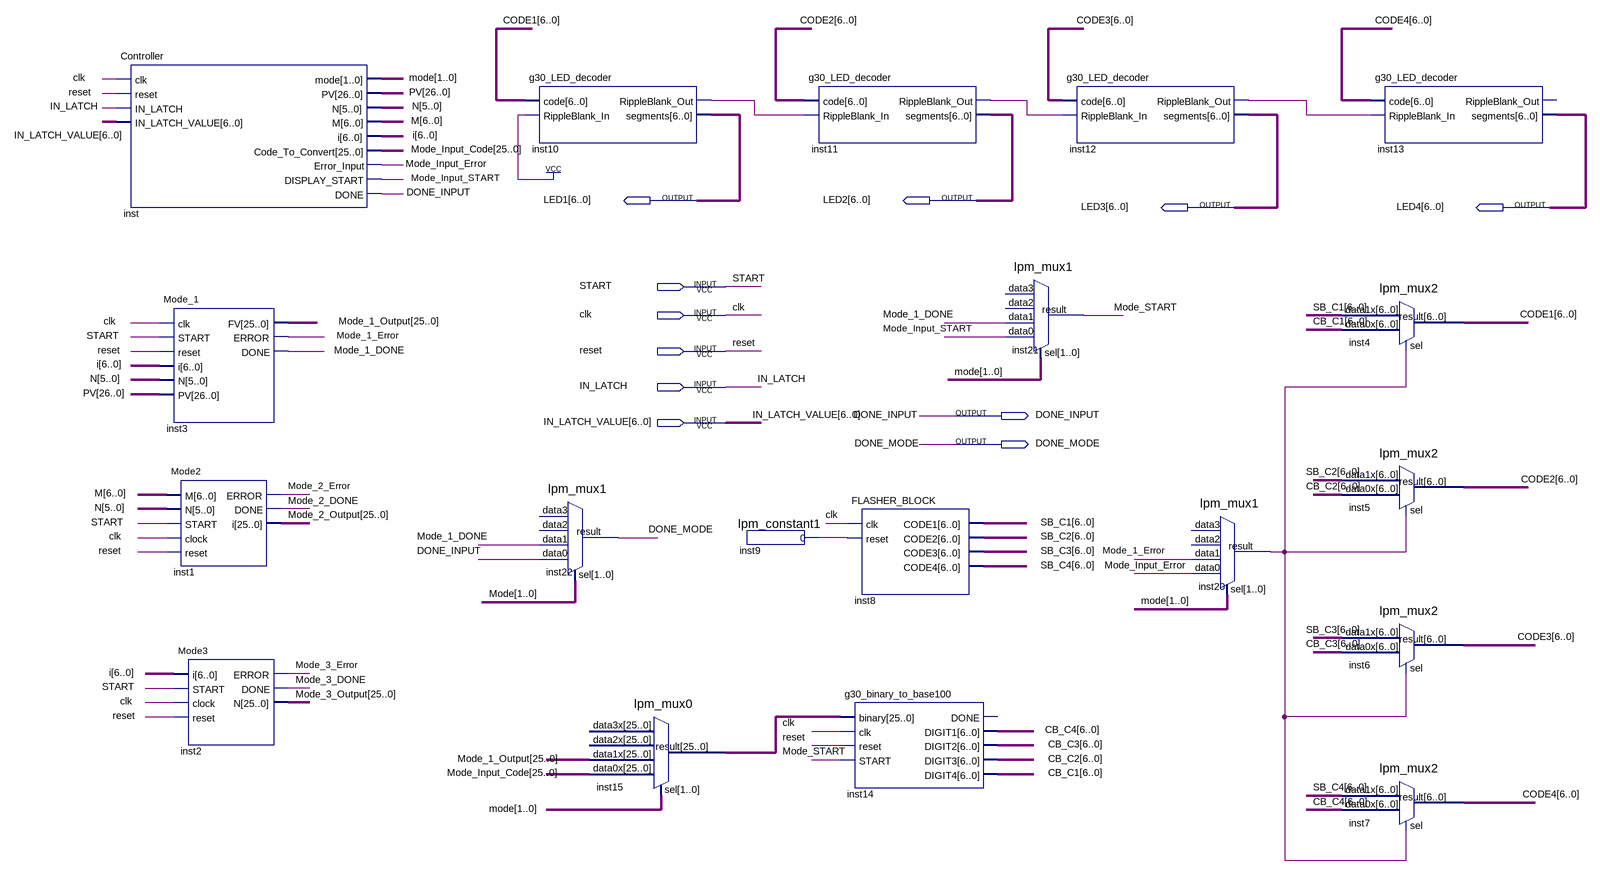
[diagram p0: schematic sheet]
// Quartus schematic g30_Base100_Financial_Calculator.bdf as structural Verilog: 19 symbols, 11 pins
module g30_Base100_Financial_Calculator (
  input  START,
  input  clk,
  input  reset,
  input  IN_LATCH,
  input  [6:0] IN_LATCH_VALUE,
  output [6:0] LED1,
  output [6:0] LED2,
  output [6:0] LED3,
  output [6:0] LED4,
  output DONE_INPUT,
  output DONE_MODE
);

  wire inst9_result, inst10_rippleblank_out, inst11_rippleblank_out, inst12_rippleblank_out, inst20_result,
       Mode_1_DONE, Mode_1_Error, Mode_2_DONE, Mode_2_Error, Mode_3_DONE, Mode_3_Error, Mode_Input_Error,
       Mode_Input_START, Mode_START;
  wire [1:0] mode;
  wire [5:0] N;
  wire [6:0] CB_C1, CB_C2, CB_C3, CB_C4, CODE1, CODE2, CODE3, CODE4, i, M, SB_C1, SB_C2, SB_C3, SB_C4;
  wire [25:0] inst15_result, Mode_1_Output, Mode_2_Output, Mode_3_Output, Mode_Input_Code;
  wire [26:0] PV;

  Controller inst (
    .clk(clk), .reset(reset), .IN_LATCH(IN_LATCH), .IN_LATCH_VALUE(IN_LATCH_VALUE), .mode(mode), .PV(PV),
    .N(N), .M(M), .i(i), .Code_To_Convert(Mode_Input_Code), .Error_Input(Mode_Input_Error),
    .DISPLAY_START(Mode_Input_START), .DONE(DONE_INPUT));
  Mode_1 inst3 (
    .clk(clk), .START(START), .reset(reset), .i(i), .N(N), .PV(PV), .FV(Mode_1_Output), .ERROR(Mode_1_Error),
    .DONE(Mode_1_DONE));
  Mode2 inst1 (
    .M(M), .N(N), .START(START), .clock(clk), .reset(reset), .ERROR(Mode_2_Error), .DONE(Mode_2_DONE),
    .i(Mode_2_Output));
  Mode3 inst2 (
    .i(i), .START(START), .clock(clk), .reset(reset), .ERROR(Mode_3_Error), .DONE(Mode_3_DONE),
    .N(Mode_3_Output));
  g30_LED_decoder inst10 (
    .code(CODE1), .RippleBlank_In(1'b1), .RippleBlank_Out(inst10_rippleblank_out), .segments(LED1));
  lpm_mux1 inst22 (.data1(Mode_1_DONE), .data0(DONE_INPUT), .sel(mode), .result(DONE_MODE));  // open: data3, data2
  lpm_mux0 inst15 (
    .data1x(Mode_1_Output), .data0x(Mode_Input_Code), .sel(mode), .result(inst15_result));  // open: data3x, data2x
  lpm_constant1 inst9 (.result(inst9_result));
  g30_LED_decoder inst11 (
    .code(CODE2), .RippleBlank_In(inst10_rippleblank_out), .RippleBlank_Out(inst11_rippleblank_out),
    .segments(LED2));
  FLASHER_BLOCK inst8 (.clk(clk), .reset(inst9_result), .CODE1(SB_C1), .CODE2(SB_C2), .CODE3(SB_C3), .CODE4(SB_C4));
  g30_binary_to_base100 inst14 (
    .binary(inst15_result), .clk(clk), .reset(reset), .START(Mode_START), .DIGIT1(CB_C4), .DIGIT2(CB_C3),
    .DIGIT3(CB_C2), .DIGIT4(CB_C1));  // open: DONE
  lpm_mux1 inst21 (
    .data1(Mode_1_DONE), .data0(Mode_Input_START), .sel(mode), .result(Mode_START));  // open: data3, data2
  g30_LED_decoder inst12 (
    .code(CODE3), .RippleBlank_In(inst11_rippleblank_out), .RippleBlank_Out(inst12_rippleblank_out),
    .segments(LED3));
  lpm_mux1 inst20 (
    .data1(Mode_1_Error), .data0(Mode_Input_Error), .sel(mode), .result(inst20_result));  // open: data3, data2
  lpm_mux2 inst4 (.data1x(SB_C1), .data0x(CB_C1), .sel(inst20_result), .result(CODE1));
  lpm_mux2 inst5 (.data1x(SB_C2), .data0x(CB_C2), .sel(inst20_result), .result(CODE2));
  lpm_mux2 inst6 (.data1x(SB_C3), .data0x(CB_C3), .sel(inst20_result), .result(CODE3));
  lpm_mux2 inst7 (.data1x(SB_C4), .data0x(CB_C4), .sel(inst20_result), .result(CODE4));
  g30_LED_decoder inst13 (
    .code(CODE4), .RippleBlank_In(inst12_rippleblank_out), .segments(LED4));  // open: RippleBlank_Out
endmodule
